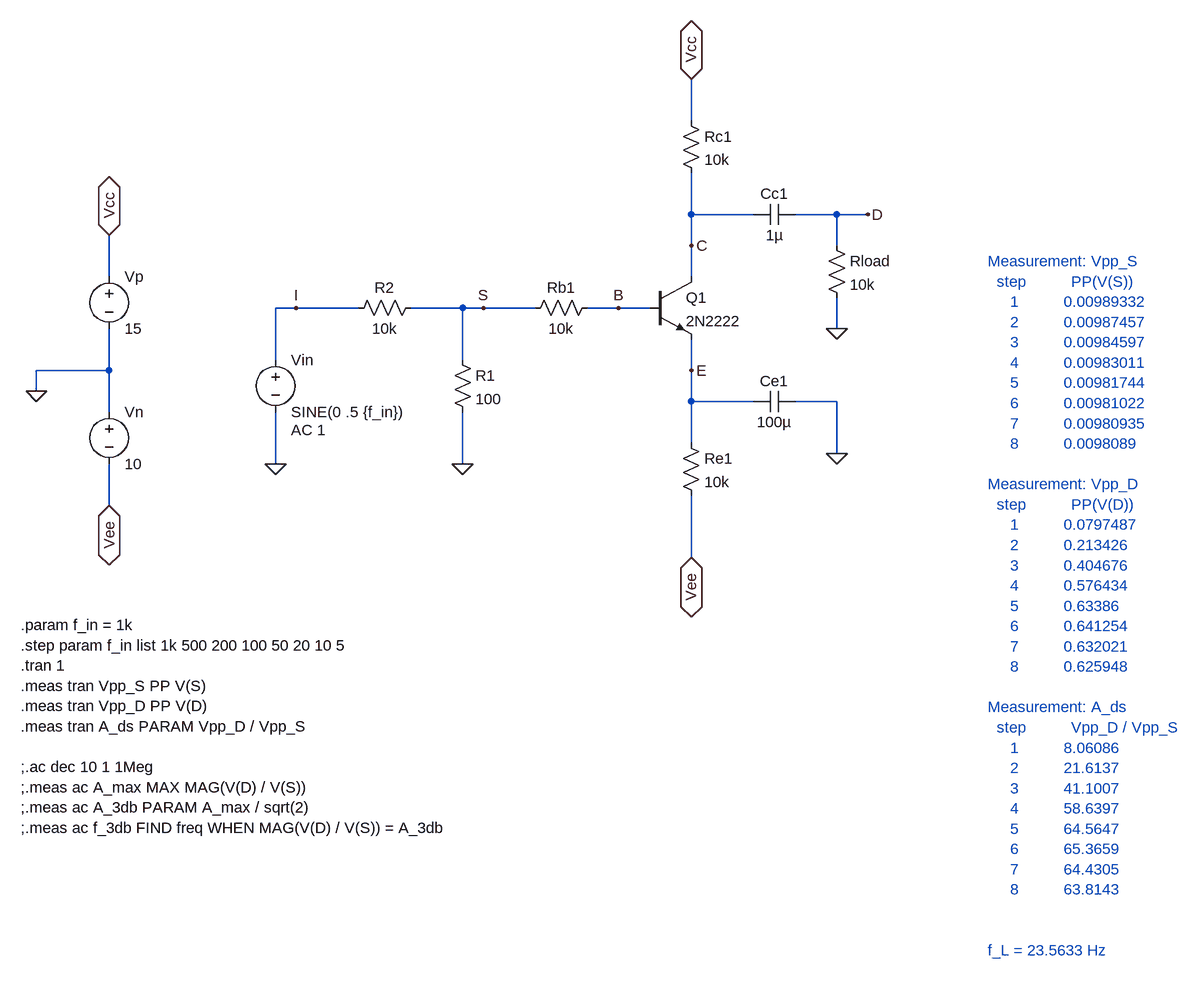
[diagram p0: schematic e2_1.asc]
e2_1.asc, the LTspice schematic file:
Version 4
SHEET 1 1936 1008
WIRE 928 -176 928 -240
WIRE 928 -32 928 -96
WIRE 1024 -32 928 -32
WIRE 1152 -32 1088 -32
WIRE 1200 -32 1152 -32
WIRE 928 16 928 -32
WIRE 1152 16 1152 -32
WIRE 32 64 32 0
WIRE 928 64 928 16
WIRE 320 112 288 112
WIRE 416 112 320 112
WIRE 576 112 496 112
WIRE 608 112 576 112
WIRE 688 112 608 112
WIRE 816 112 768 112
WIRE 864 112 816 112
WIRE 1152 144 1152 96
WIRE 288 192 288 112
WIRE 576 192 576 112
WIRE 32 208 32 144
WIRE 32 208 -80 208
WIRE 928 208 928 160
WIRE -80 240 -80 208
WIRE 928 256 928 208
WIRE 1024 256 928 256
WIRE 1152 256 1088 256
WIRE 32 272 32 208
WIRE 928 320 928 256
WIRE 1152 336 1152 256
WIRE 288 352 288 272
WIRE 576 352 576 272
WIRE 32 416 32 352
WIRE 928 496 928 400
FLAG -80 240 0
FLAG 32 0 Vcc
IOPIN 32 0 BiDir
FLAG 32 416 Vee
IOPIN 32 416 BiDir
FLAG 288 352 0
FLAG 576 352 0
FLAG 928 -240 Vcc
IOPIN 928 -240 BiDir
FLAG 928 496 Vee
IOPIN 928 496 BiDir
FLAG 1152 336 0
FLAG 320 112 I
FLAG 608 112 S
FLAG 816 112 B
FLAG 928 208 E
FLAG 928 16 C
FLAG 1152 144 0
FLAG 1200 -32 D
SYMBOL voltage 32 48 R0
SYMATTR InstName Vp
SYMATTR Value 15
SYMBOL voltage 32 256 R0
SYMATTR InstName Vn
SYMATTR Value 10
SYMBOL res 560 176 R0
SYMATTR InstName R1
SYMATTR Value 100
SYMBOL res 400 128 R270
WINDOW 0 32 56 VTop 2
WINDOW 3 0 56 VBottom 2
SYMATTR InstName R2
SYMATTR Value 10k
SYMBOL res 672 128 R270
WINDOW 0 32 56 VTop 2
WINDOW 3 0 56 VBottom 2
SYMATTR InstName Rb1
SYMATTR Value 10k
SYMBOL npn 864 64 R0
SYMATTR InstName Q1
SYMATTR Value 2N2222
SYMBOL res 912 -192 R0
SYMATTR InstName Rc1
SYMATTR Value 10k
SYMBOL res 912 304 R0
SYMATTR InstName Re1
SYMATTR Value 10k
SYMBOL cap 1088 240 R90
WINDOW 0 0 32 VBottom 2
WINDOW 3 32 32 VTop 2
SYMATTR InstName Ce1
SYMATTR Value 100µ
SYMBOL cap 1088 -48 R90
WINDOW 0 0 32 VBottom 2
WINDOW 3 32 32 VTop 2
SYMATTR InstName Cc1
SYMATTR Value 1µ
SYMBOL res 1136 0 R0
SYMATTR InstName Rload
SYMATTR Value 10k
SYMBOL voltage 288 176 R0
WINDOW 123 24 124 Left 2
WINDOW 39 0 0 Left 0
SYMATTR Value2 AC 1
SYMATTR InstName Vin
SYMATTR Value SINE(0 .5 {f_in})
TEXT -104 600 Left 2 !.param f_in = 1k\n.step param f_in list 1k 500 200 100 50 20 10 5\n.tran 1\n.meas tran Vpp_S PP V(S)\n.meas tran Vpp_D PP V(D)\n.meas tran A_ds PARAM Vpp_D / Vpp_S\n \n;.ac dec 10 1 1Meg\n;.meas ac A_max MAX MAG(V(D) / V(S))\n;.meas ac A_3db PARAM A_max / sqrt(2)\n;.meas ac f_3db FIND freq WHEN MAG(V(D) / V(S)) = A_3db
TEXT 1384 40 Left 2 ;Measurement: Vpp_S\n  step          PP(V(S))\n     1          0.00989332\n     2          0.00987457\n     3          0.00984597\n     4          0.00983011\n     5          0.00981744\n     6          0.00981022\n     7          0.00980935\n     8          0.0098089\n \nMeasurement: Vpp_D\n  step          PP(V(D))\n     1          0.0797487\n     2          0.213426\n     3          0.404676\n     4          0.576434\n     5          0.63386\n     6          0.641254\n     7          0.632021\n     8          0.625948\n \nMeasurement: A_ds\n  step          Vpp_D / Vpp_S\n     1          8.06086\n     2          21.6137\n     3          41.1007\n     4          58.6397\n     5          64.5647\n     6          65.3659\n     7          64.4305\n     8          63.8143\n \n \nf_L = 23.5633 Hz

The netlist it stands for:
* e2_1.asc
Vp Vcc 0 15
Vn 0 Vee 10
R1 S 0 100
R2 I S 10k
Rb1 S B 10k
Q1 C B E 0 2N2222
Rc1 Vcc C 10k
Re1 E Vee 10k
Ce1 0 E 100µ
Cc1 D C 1µ
Rload D 0 10k
Vin I 0 SINE(0 .5 {f_in}) AC 1
.model NPN NPN
.model PNP PNP
.lib standard.bjt
.param f_in = 1k
.step param f_in list 1k 500 200 100 50 20 10 5
.tran 1
.meas tran Vpp_S PP V(S)
.meas tran Vpp_D PP V(D)
.meas tran A_ds PARAM Vpp_D / Vpp_S
;.ac dec 10 1 1Meg
;.meas ac A_max MAX MAG(V(D) / V(S))
;.meas ac A_3db PARAM A_max / sqrt(2)
;.meas ac f_3db FIND freq WHEN MAG(V(D) / V(S)) = A_3db
* Measurement: Vpp_S
*   step          PP(V(S))
*      1          0.00989332
*      2          0.00987457
*      3          0.00984597
*      4          0.00983011
*      5          0.00981744
*      6          0.00981022
*      7          0.00980935
*      8          0.0098089
* Measurement: Vpp_D
*   step          PP(V(D))
*      1          0.0797487
*      2          0.213426
*      3          0.404676
*      4          0.576434
*      5          0.63386
*      6          0.641254
*      7          0.632021
*      8          0.625948
* Measurement: A_ds
*   step          Vpp_D / Vpp_S
*      1          8.06086
*      2          21.6137
*      3          41.1007
*      4          58.6397
*      5          64.5647
*      6          65.3659
*      7          64.4305
*      8          63.8143
* f_L = 23.5633 Hz
.backanno
.end